# EAGLE design throwing_bagels (EAGLE 9.5.2)
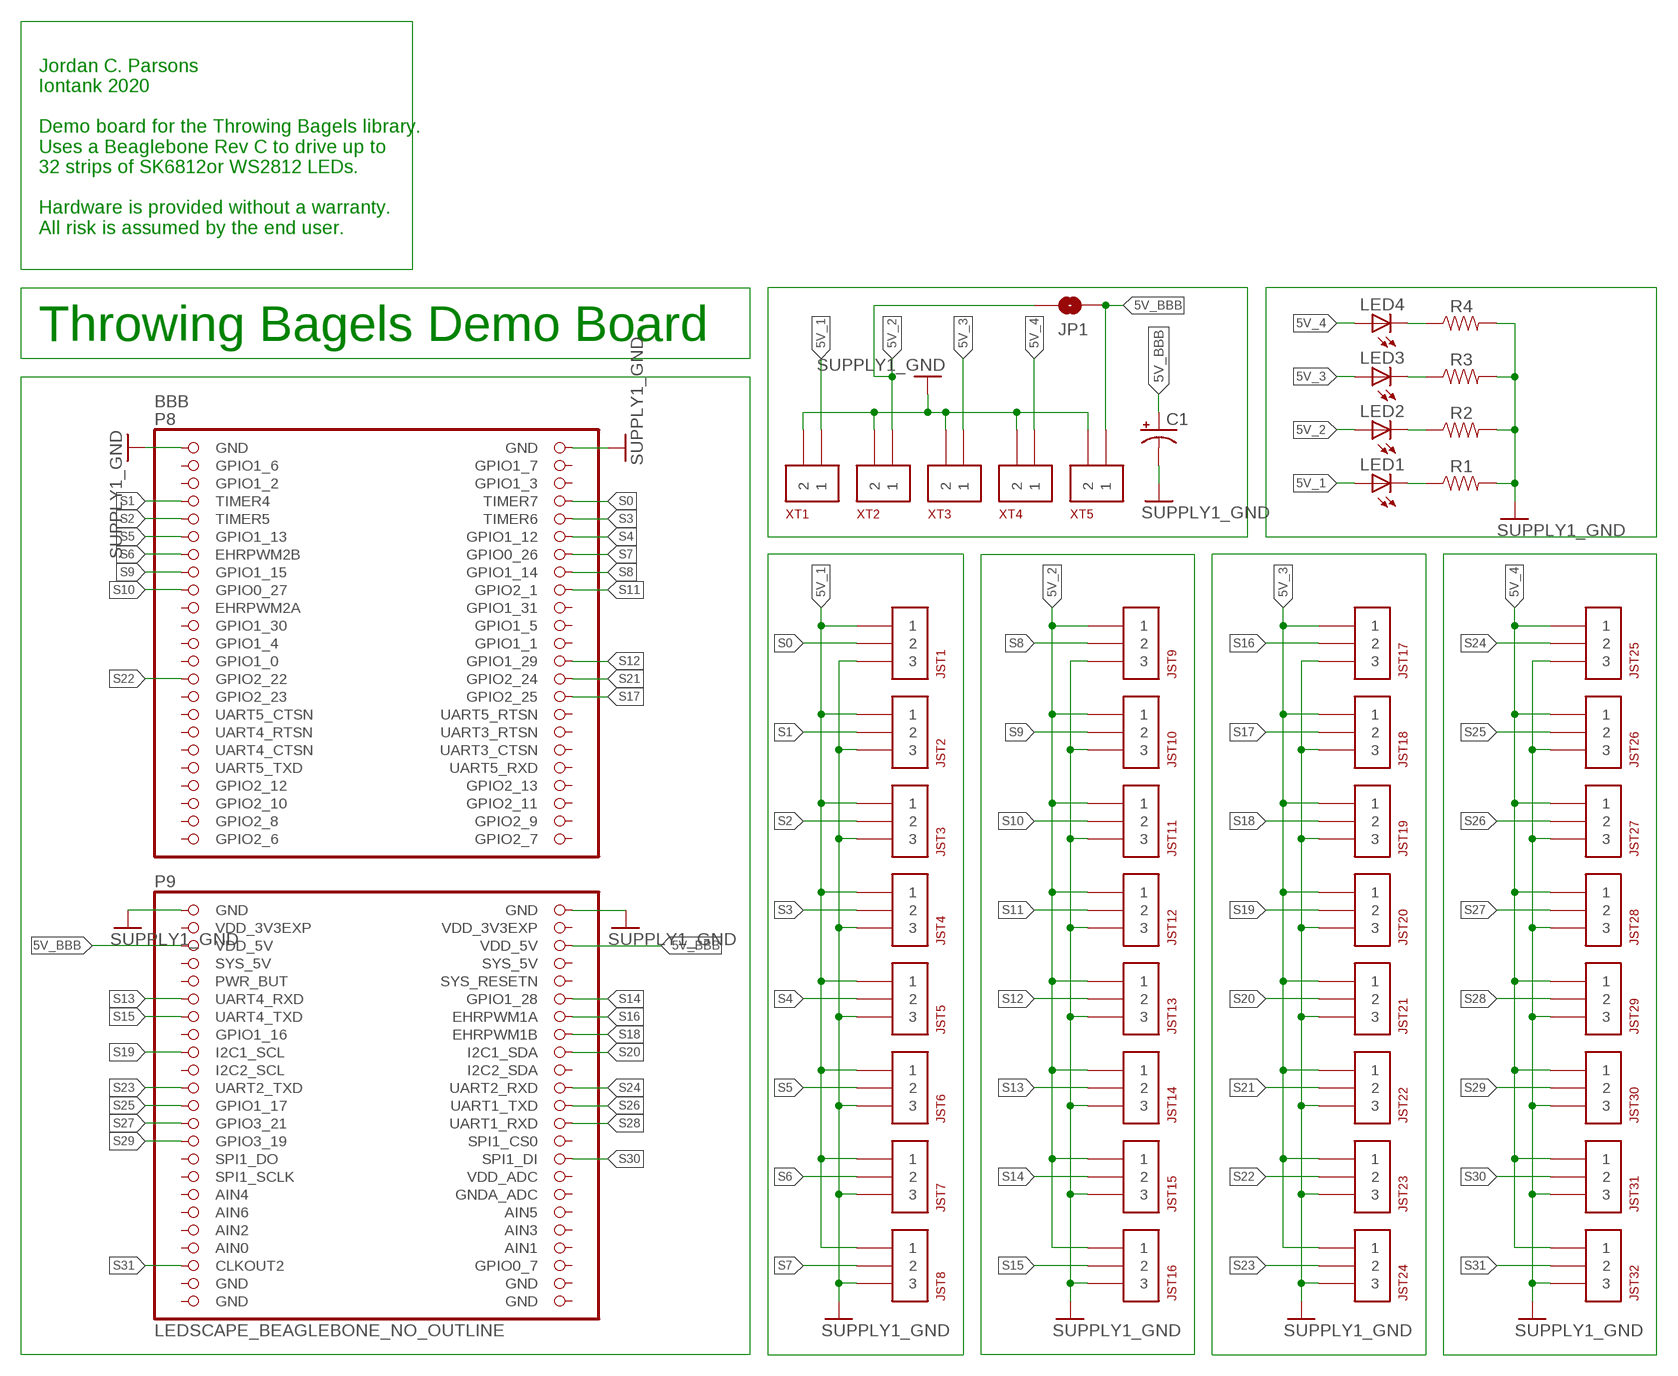
[diagram p0: schematic, sheet 1]

## Parts
BBB  LEDSCAPE_BEAGLEBONE_NO_OUTLINE  [BEAGLEBONE_SHIELD_NO_OUTLINE]
C1  ADAFRUIT_CPOL-USE2,5-6E  [ADAFRUIT_E2,5-6E]
JP1  SPARKFUN-JUMPERS_JUMPER-SMT_2_NO_SILK  [SPARKFUN-JUMPERS_SMT-JUMPER_2_NO_SILK]
JST1  IONTANK-JCP_JST-XH-SIDE-3  [JST-XH-SIDE-3]
JST2  IONTANK-JCP_JST-XH-SIDE-3  [JST-XH-SIDE-3]
JST3  IONTANK-JCP_JST-XH-SIDE-3  [JST-XH-SIDE-3]
JST4  IONTANK-JCP_JST-XH-SIDE-3  [JST-XH-SIDE-3]
JST5  IONTANK-JCP_JST-XH-SIDE-3  [JST-XH-SIDE-3]
JST6  IONTANK-JCP_JST-XH-SIDE-3  [JST-XH-SIDE-3]
JST7  IONTANK-JCP_JST-XH-SIDE-3  [JST-XH-SIDE-3]
JST8  IONTANK-JCP_JST-XH-SIDE-3  [JST-XH-SIDE-3]
JST9  IONTANK-JCP_JST-XH-SIDE-3  [JST-XH-SIDE-3]
JST10  IONTANK-JCP_JST-XH-SIDE-3  [JST-XH-SIDE-3]
JST11  IONTANK-JCP_JST-XH-SIDE-3  [JST-XH-SIDE-3]
JST12  IONTANK-JCP_JST-XH-SIDE-3  [JST-XH-SIDE-3]
JST13  IONTANK-JCP_JST-XH-SIDE-3  [JST-XH-SIDE-3]
JST14  IONTANK-JCP_JST-XH-SIDE-3  [JST-XH-SIDE-3]
JST15  IONTANK-JCP_JST-XH-SIDE-3  [JST-XH-SIDE-3]
JST16  IONTANK-JCP_JST-XH-SIDE-3  [JST-XH-SIDE-3]
JST17  IONTANK-JCP_JST-XH-SIDE-3  [JST-XH-SIDE-3]
JST18  IONTANK-JCP_JST-XH-SIDE-3  [JST-XH-SIDE-3]
JST19  IONTANK-JCP_JST-XH-SIDE-3  [JST-XH-SIDE-3]
JST20  IONTANK-JCP_JST-XH-SIDE-3  [JST-XH-SIDE-3]
JST21  IONTANK-JCP_JST-XH-SIDE-3  [JST-XH-SIDE-3]
JST22  IONTANK-JCP_JST-XH-SIDE-3  [JST-XH-SIDE-3]
JST23  IONTANK-JCP_JST-XH-SIDE-3  [JST-XH-SIDE-3]
JST24  IONTANK-JCP_JST-XH-SIDE-3  [JST-XH-SIDE-3]
JST25  IONTANK-JCP_JST-XH-SIDE-3  [JST-XH-SIDE-3]
JST26  IONTANK-JCP_JST-XH-SIDE-3  [JST-XH-SIDE-3]
JST27  IONTANK-JCP_JST-XH-SIDE-3  [JST-XH-SIDE-3]
JST28  IONTANK-JCP_JST-XH-SIDE-3  [JST-XH-SIDE-3]
JST29  IONTANK-JCP_JST-XH-SIDE-3  [JST-XH-SIDE-3]
JST30  IONTANK-JCP_JST-XH-SIDE-3  [JST-XH-SIDE-3]
JST31  IONTANK-JCP_JST-XH-SIDE-3  [JST-XH-SIDE-3]
JST32  IONTANK-JCP_JST-XH-SIDE-3  [JST-XH-SIDE-3]
LED1  LEDCHIPLED_0603  [CHIPLED_0603]
LED2  LEDCHIPLED_0603  [CHIPLED_0603]
LED3  LEDCHIPLED_0603  [CHIPLED_0603]
LED4  LEDCHIPLED_0603  [CHIPLED_0603]
R1  RESISTOR0603  [0603]
R2  RESISTOR0603  [0603]
R3  RESISTOR0603  [0603]
R4  RESISTOR0603  [0603]
XT1  IONTANK-JCP_XT60PWXT60PW-F20  [XT60PW-F20]
XT2  IONTANK-JCP_XT60PWXT60PW-F20  [XT60PW-F20]
XT3  IONTANK-JCP_XT60PWXT60PW-F20  [XT60PW-F20]
XT4  IONTANK-JCP_XT60PWXT60PW-F20  [XT60PW-F20]
XT5  IONTANK-JCP_XT30PW  [XT30PW-F]

## Nets
5V_1: JST1.P$1 JST2.P$1 JST3.P$1 JST4.P$1 JST5.P$1 JST6.P$1 JST7.P$1 JST8.P$1 LED1.A XT1.VCC
5V_2: JP1.1 JST9.P$1 JST10.P$1 JST11.P$1 JST12.P$1 JST13.P$1 JST14.P$1 JST15.P$1 JST16.P$1 LED2.A XT2.VCC
5V_3: JST17.P$1 JST18.P$1 JST19.P$1 JST20.P$1 JST21.P$1 JST22.P$1 JST23.P$1 JST24.P$1 LED3.A XT3.VCC
5V_4: JST25.P$1 JST26.P$1 JST27.P$1 JST28.P$1 JST29.P$1 JST30.P$1 JST31.P$1 JST32.P$1 LED4.A XT4.VCC
5V_BBB: BBB.51(VDD_5V) BBB.52(VDD_5V) C1.+ JP1.2 XT5.POS
GND: BBB.1(GND) BBB.2(GND) BBB.47(GND) BBB.48(GND) C1.- JST1.P$3 JST2.P$3 JST3.P$3 JST4.P$3 JST5.P$3 JST6.P$3 JST7.P$3 JST8.P$3 JST9.P$3 JST10.P$3 JST11.P$3 JST12.P$3 JST13.P$3 JST14.P$3 JST15.P$3 JST16.P$3 JST17.P$3 JST18.P$3 JST19.P$3 JST20.P$3 JST21.P$3 JST22.P$3 JST23.P$3 JST24.P$3 JST25.P$3 JST26.P$3 JST27.P$3 JST28.P$3 JST29.P$3 JST30.P$3 JST31.P$3 JST32.P$3 R1.2 R2.2 R3.2 R4.2 XT1.GND XT2.GND XT3.GND XT4.GND XT5.NEG ; supply symbol labelled SUPPLY1_GND
N$1: LED4.C R4.1
N$10: LED3.C R3.1
N$11: LED2.C R2.1
N$17: LED1.C R1.1
S0: BBB.8(TIMER7) JST1.P$2
S1: BBB.7(TIMER4) JST2.P$2
S2: BBB.9(TIMER5) JST3.P$2
S3: BBB.10(TIMER6) JST4.P$2
S4: BBB.12(GPIO1_12) JST5.P$2
S5: BBB.11(GPIO1_13) JST6.P$2
S6: BBB.13(EHRPWM2B) JST7.P$2
S7: BBB.14(GPIO0_26) JST8.P$2
S8: BBB.16(GPIO1_14) JST9.P$2
S9: BBB.15(GPIO1_15) JST10.P$2
S10: BBB.17(GPIO0_27) JST11.P$2
S11: BBB.18(GPIO2_1) JST12.P$2
S12: BBB.26(GPIO1_29) JST13.P$2
S13: BBB.57(UART4_RXD) JST14.P$2
S14: BBB.58(GPIO1_28) JST15.P$2
S15: BBB.59(UART4_TXD) JST16.P$2
S16: BBB.60(EHRPWM1A) JST17.P$2
S17: BBB.30(GPIO2_25) JST18.P$2
S18: BBB.62(EHRPWM1B) JST19.P$2
S19: BBB.63(I2C1_SCL) JST20.P$2
S20: BBB.64(I2C1_SDA) JST21.P$2
S21: BBB.28(GPIO2_24) JST22.P$2
S22: BBB.27(GPIO2_22) JST23.P$2
S23: BBB.67(UART2_TXD) JST24.P$2
S24: BBB.68(UART2_RXD) JST25.P$2
S25: BBB.69(GPIO1_17) JST26.P$2
S26: BBB.70(UART1_TXD) JST27.P$2
S27: BBB.71(GPIO3_21) JST28.P$2
S28: BBB.72(UART1_RXD) JST29.P$2
S29: BBB.73(GPIO3_19) JST30.P$2
S30: BBB.76(SPI1_DI) JST31.P$2
S31: BBB.87(CLKOUT2) JST32.P$2
Unconnected: BBB.3(GPIO1_6) BBB.4(GPIO1_7) BBB.5(GPIO1_2) BBB.6(GPIO1_3) BBB.19(EHRPWM2A) BBB.20(GPIO1_31) BBB.21(GPIO1_30) BBB.22(GPIO1_5) BBB.23(GPIO1_4) BBB.24(GPIO1_1) BBB.25(GPIO1_0) BBB.29(GPIO2_23) BBB.31(UART5_CTSN) BBB.32(UART5_RTSN) BBB.33(UART4_RTSN) BBB.34(UART3_RTSN) BBB.35(UART4_CTSN) BBB.36(UART3_CTSN) BBB.37(UART5_TXD) BBB.38(UART5_RXD) BBB.39(GPIO2_12) BBB.40(GPIO2_13) BBB.41(GPIO2_10) BBB.42(GPIO2_11) BBB.43(GPIO2_8) BBB.44(GPIO2_9) BBB.45(GPIO2_6) BBB.46(GPIO2_7) BBB.54(SYS_5V) BBB.55(PWR_BUT) BBB.56(SYS_RESETN) BBB.61(GPIO1_16) BBB.65(I2C2_SCL) BBB.66(I2C2_SDA) BBB.74(SPI1_CS0) BBB.75(SPI1_DO) BBB.77(SPI1_SCLK) BBB.78(VDD_ADC) BBB.79(AIN4) BBB.80(GNDA_ADC) BBB.81(AIN6) BBB.82(AIN5) BBB.83(AIN2) BBB.84(AIN3) BBB.86(AIN1) BBB.88(GPIO0_7)

## Notes on the sheet
- Jordan C. Parsons
  Iontank 2020
  
  Demo board for the Throwing Bagels library.
  Uses a Beaglebone Rev C to drive up to 
  32 strips of SK6812or WS2812 LEDs. 
  
  Hardware is provided without a warranty. 
  All risk is assumed by the end user.
- Throwing Bagels Demo Board

## Power pins joined to a net without a drawn wire
AIN0: BBB.85(AIN0)
GND: BBB.89(GND) BBB.90(GND) BBB.91(GND) BBB.92(GND)
SYS_5V: BBB.53(SYS_5V)
VDD_3V3EXP: BBB.49(VDD_3V3EXP) BBB.50(VDD_3V3EXP)

## Library data of the parts
BBB = throwing_bagels:LEDSCAPE_BEAGLEBONE_NO_OUTLINE: Should match A3 pinout - but not completely tested
C1 = throwing_bagels:ADAFRUIT_CPOL-US: POLARIZED CAPACITOR, American symbol
JP1 = throwing_bagels:SPARKFUN-JUMPERS_JUMPER-SMT_2_NO: Normally open jumper This jumper has two pads in close proximity to each other. Apply solder to close the connection. Round pads are easier to solder for beginners, but are a lot larger. SparkFun Product that uses the round pads: SparkFun EL Sequencer <https://www.sparkfun.com/products/12781>
JST1-JST32 = throwing_bagels:IONTANK-JCP_JST-XH-SIDE-3: http://www.jst-mfg.com/product/pdf/eng/eXH.pdf
LED1-LED4 = adafruit:LED: LED OSRAM: - CHIPLED LG R971, LG N971, LY N971, LG Q971, LY Q971, LO R971, LY R971 LH N974, LH R974 LS Q976, LO Q976, LY Q976 LO Q996 - Hyper CHIPLED LW Q18S LB Q993, LB Q99A, LB R99A - SideLED LS A670, LO A670, LY A670, LG A670, LP A670 LB A673, LV A673, LT A673, LW A673 LH A674 LY A675 LS A676, LA A676, LO A676, LY A676, LW A676 LS A679, LY A679, LG A679 - Hyper Micro SIDELED® LS Y876, LA Y876, LO Y876, LY Y876 LT Y87S - SmartLED LW L88C, LW L88S LB L89C, LB L89S, LG L890 LS L89K, LO L89K, LY L89K LS L896, LA L896, LO L896, LY L896 - TOPLED LS T670, LO T670, LY T670, LG T670, LP T670 LSG T670, LSP T670, LSY T670, LOP T670, LYG T670 LG T671, LOG T671, LSG T671 LB T673, LV T673, LT T673, LW T673 LH T674 LS T676, LA T676, LO T676, LY T676, LB T676, LH T676, LSB T676, LW T676 LB T67C, LV T67C, LT T67C, LS T67K, LO T67K, LY T67K, LW E67C LS E67B, LA E67B, LO E67B, LY E67B, LB E67C, LV E67C, LT E67C LW T67C LS T679, LY T679, LG T679 LS T770, LO T770, LY T770, LG T770, LP T770 LB T773, LV T773, LT T773, LW T773 LH T774 LS E675, LA E675, LY E675, LS T675 LS T776, LA T776, LO T776, LY T776, LB T776 LHGB T686 LT T68C, LB T68C - Hyper Mini TOPLED® LB M676 - Mini TOPLED Santana® LG M470 LS M47K, LO M47K, LY M47K Source: http://www.osram.convergy.de/
R1-R4 = SparkFun-Resistors:RESISTOR: Generic Resistor Package
XT1-XT4 = throwing_bagels:IONTANK-JCP_XT60PW
XT5 = throwing_bagels:IONTANK-JCP_XT30PW

## Board
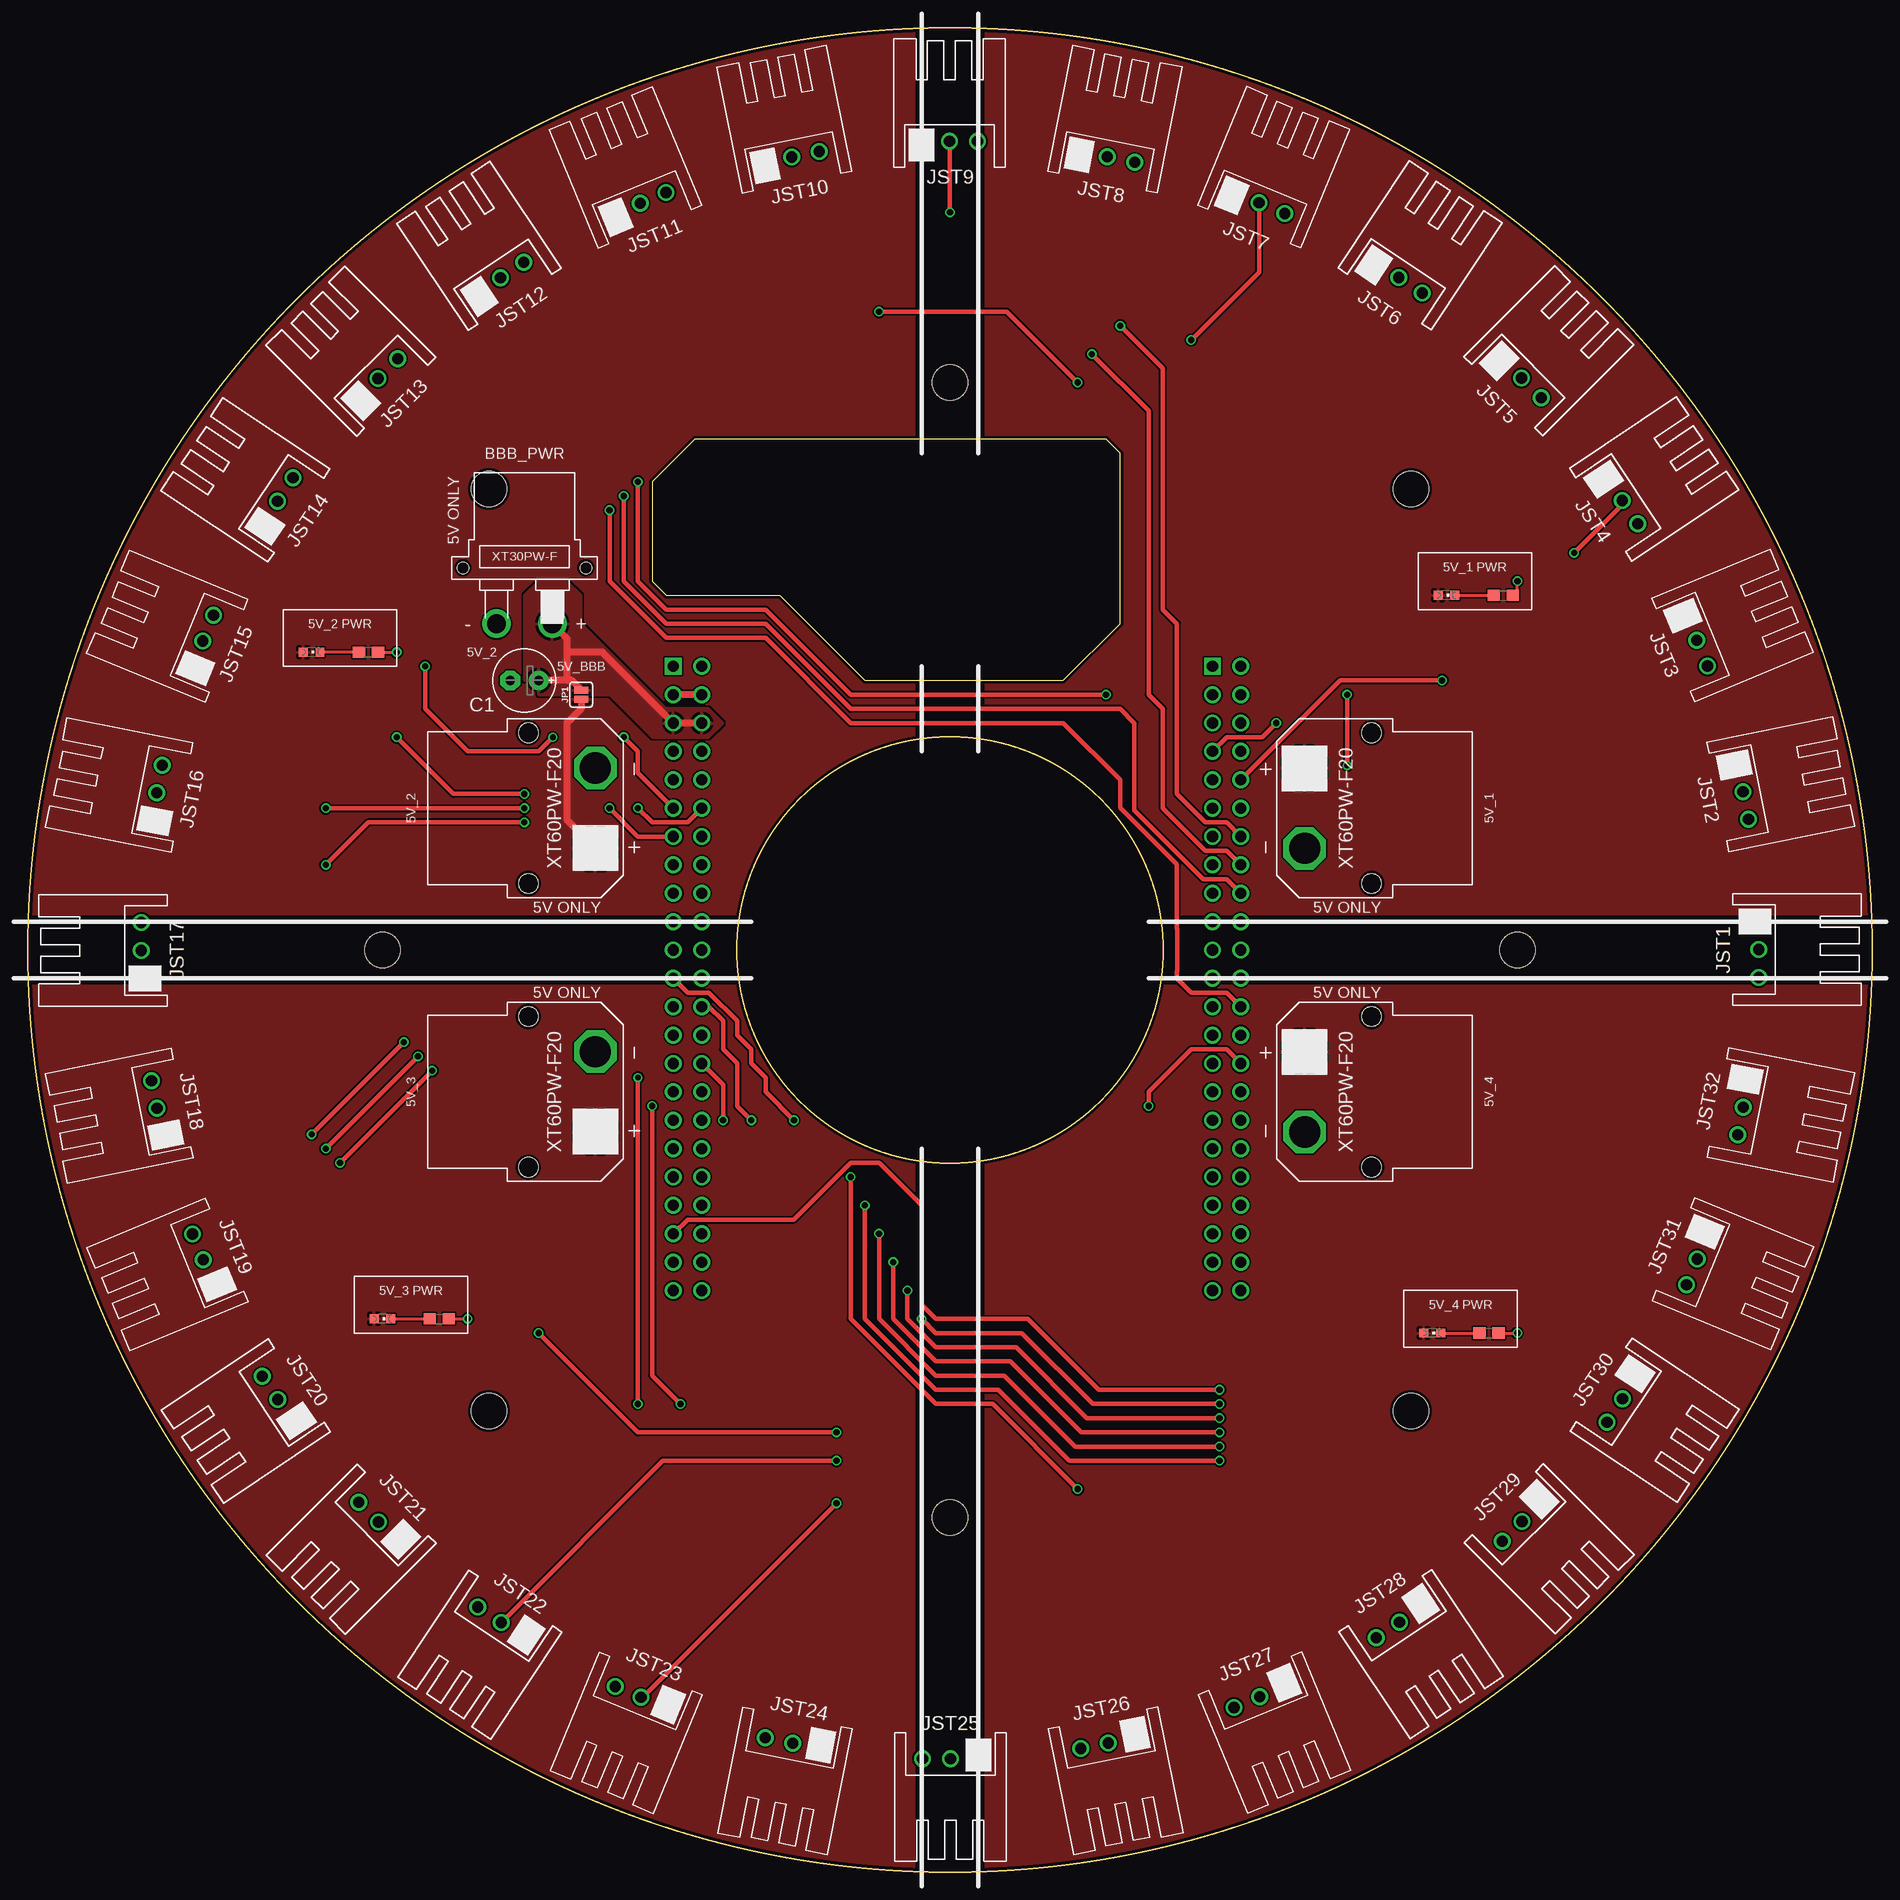
[diagram p1: board, top side]
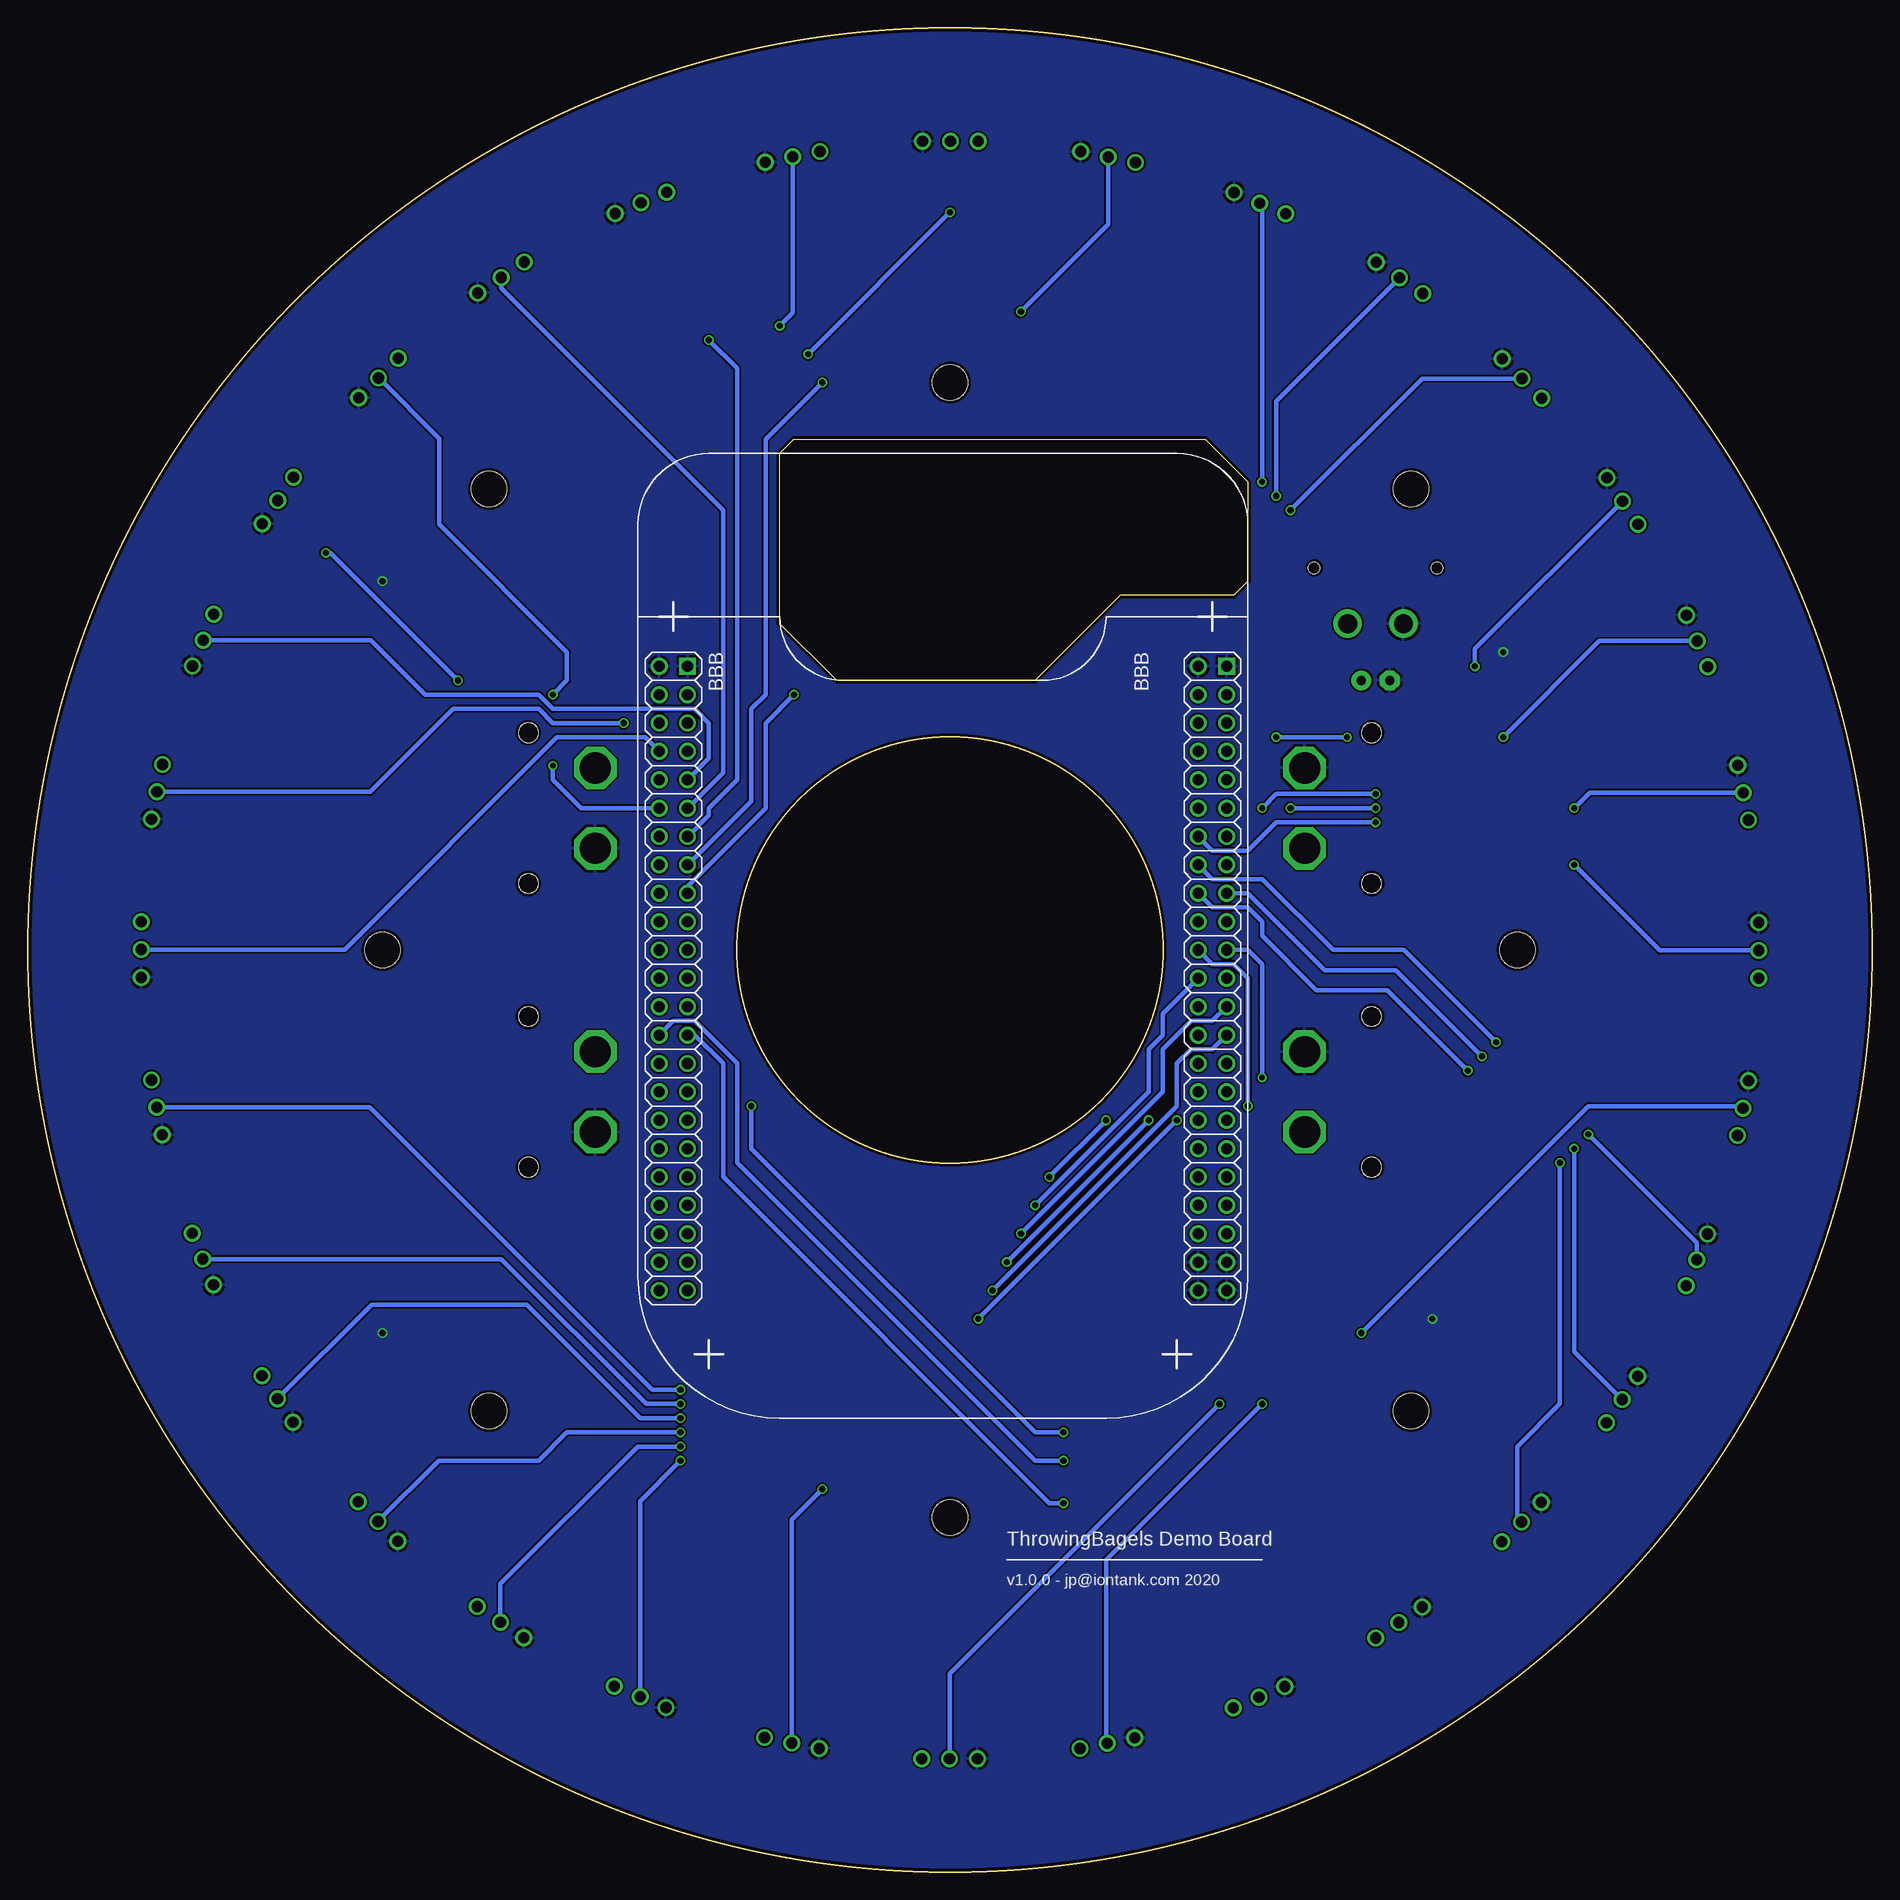
[diagram p2: board, bottom side, seen from below]

Size 165.1 x 165.1 mm. Coordinates in mm from the lower left corner, seen from the top.
Outline: 59.69,128.27 55.88,124.46 55.88,115.57 57.15,114.3 67.31,114.3 74.93,106.68 92.71,106.68 97.79,111.76 97.79,127 96.52,128.27 59.69,128.27
Outline: circle at 82.55,82.55 radius 19.05
Outline: circle at 82.55,82.55 radius 82.55
Copper layers (1*16): Top 0.035mm / dielectric 1.5mm / Bottom 0.035mm
Design rules "SeeedStudio_2layer_DRU_no_angle_20140221": minimum track width 6mil, minimum drill 12mil, track to track 6mil, track to pad 6mil, pad to pad 6mil, via to via 6mil, smd to smd 0mil, copper to edge 10mil, drill to drill 10mil, minimum pad ring 10mil, minimum via ring 6mil, stop-mask expansion 2mil, vias tented up to drill 100mil, thermal gap 10mil
Holes 3.17 mm at 82.55,133.35 31.75,82.55 133.35,82.55 82.55,31.75 41.27,41.27 41.27,123.82 123.82,123.82 123.82,41.27

### Footprints (pad centres in the part's own frame; a part is rotated, then mirrored left to right if it is on the bottom)
BEAGLEBONE_SHIELD_NO_OUTLINE = drill 1 square: 1 4.445,19.05; 47 52.705,19.05 | drill 1: 2 1.905,19.05; 3 4.445,21.59; 4 1.905,21.59; 5 4.445,24.13; 6 1.905,24.13; 7 4.445,26.67; 8 1.905,26.67; 9 4.445,29.21; 10 1.905,29.21; 11 4.445,31.75; 12 1.905,31.75; 13 4.445,34.29; 14 1.905,34.29; 15 4.445,36.83; 16 1.905,36.83; 17 4.445,39.37; 18 1.905,39.37; 19 4.445,41.91; 20 1.905,41.91; 21 4.445,44.45; 22 1.905,44.45; 23 4.445,46.99; 24 1.905,46.99; 25 4.445,49.53; 26 1.905,49.53; 27 4.445,52.07; 28 1.905,52.07; 29 4.445,54.61; 30 1.905,54.61; 31 4.445,57.15; 32 1.905,57.15; 33 4.445,59.69; 34 1.905,59.69; 35 4.445,62.23; 36 1.905,62.23; 37 4.445,64.77; 38 1.905,64.77; 39 4.445,67.31; 40 1.905,67.31; 41 4.445,69.85; 42 1.905,69.85; 43 4.445,72.39; 44 1.905,72.39; 45 4.445,74.93; 46 1.905,74.93; 48 50.165,19.05; 49 52.705,21.59; 50 50.165,21.59; 51 52.705,24.13; 52 50.165,24.13; 53 52.705,26.67; 54 50.165,26.67; 55 52.705,29.21; 56 50.165,29.21; 57 52.705,31.75; 58 50.165,31.75; 59 52.705,34.29; 60 50.165,34.29; 61 52.705,36.83; 62 50.165,36.83; 63 52.705,39.37; 64 50.165,39.37; 65 52.705,41.91; 66 50.165,41.91; 67 52.705,44.45; 68 50.165,44.45; 69 52.705,46.99; 70 50.165,46.99; 71 52.705,49.53; 72 50.165,49.53; 73 52.705,52.07; 74 50.165,52.07; 75 52.705,54.61; 76 50.165,54.61; 77 52.705,57.15; 78 50.165,57.15; 79 52.705,59.69; 80 50.165,59.69; 81 52.705,62.23; 82 50.165,62.23; 83 52.705,64.77; 84 50.165,64.77; 85 52.705,67.31; 86 50.165,67.31; 87 52.705,69.85; 88 50.165,69.85; 89 52.705,72.39; 90 50.165,72.39; 91 52.705,74.93; 92 50.165,74.93
ADAFRUIT_E2,5-6E = drill 0.813 pad 1.778: + -1.27,0 | drill 0.813 pad 1.778 octagon: - 1.27,0
SPARKFUN-JUMPERS_SMT-JUMPER_2_NO_SILK = smd 0.635 x 1.27: 1 -0.406,0; 2 0.406,0
JST-XH-SIDE-3 = drill 1: P$1 -2.54,-3.81; P$2 -0.04,-3.81; P$3 2.46,-3.81
CHIPLED_0603 = smd 0.8 x 0.8: A 0,-0.75; C 0,0.75
0603 = smd 1.1 x 1: 1 -0.85,0; 2 0.85,0
XT60PW-F20 = drill 2.8 octagon: GND 3.6,0; VCC -3.6,0 | hole 1.75: 6.75,6; -6.75,6
XT30PW-F = drill 1.7: NEG -2.5,0; POS 2.5,0 | hole 1: 5.5,5; -5.5,5

### Placement (x,y rotation side)
BBB  110.49,127 180 top
C1  44.45,106.68 180 top
JP1  49.53,105.41 90 top
JST1  158.75,82.55 270 top
JST2  157.29,97.42 281.3 top
JST3  152.95,111.71 292.5 top
JST4  145.91,124.88 303.8 top
JST5  136.43,136.43 315 top
JST6  124.88,145.91 326.3 top
JST7  111.71,152.95 337.5 top
JST8  97.42,157.29 348.8 top
JST9  82.55,158.75 0 top
JST10  67.68,157.29 11.3 top
JST11  53.39,152.95 22.5 top
JST12  40.22,145.91 33.8 top
JST13  28.67,136.43 45 top
JST14  19.19,124.88 56.3 top
JST15  12.15,111.71 67.5 top
JST16  7.81,97.42 78.8 top
JST17  6.35,82.55 90 top
JST18  7.81,67.68 101.3 top
JST19  12.15,53.39 112.5 top
JST20  19.19,40.22 123.8 top
JST21  28.67,28.67 135 top
JST22  40.22,19.19 146.3 top
JST23  53.39,12.15 157.5 top
JST24  67.68,7.81 168.8 top
JST25  82.55,6.35 180 top
JST26  97.42,7.81 191.3 top
JST27  111.71,12.15 202.5 top
JST28  124.88,19.19 213.8 top
JST29  136.43,28.67 225 top
JST30  145.91,40.22 236.3 top
JST31  152.95,53.39 247.5 top
JST32  157.29,67.68 258.8 top
LED1  127,114.3 270 top
LED2  25.4,109.22 270 top
LED3  31.75,49.53 270 top
LED4  125.73,48.26 270 top
R1  132.08,114.3 0 top
R2  30.48,109.22 0 top
R3  36.83,49.53 0 top
R4  130.81,48.26 0 top
XT1  114.3,95.25 270 top
XT2  50.8,95.25 90 top
XT3  50.8,69.85 90 top
XT4  114.3,69.85 270 top
XT5  44.45,111.76 0 top

### Tracks (layer width: path | path; a pad name or v marks a point on that pad's centre or on a via)
5V_1
  pour Top: 85.72,168.27 85.72,136.53 85.72,85.72 117.47,85.72 168.27,85.72 168.27,88.9 168.27,168.27
5V_2
  Top 0.61: XT2.VCC 48.26,94.19 48.26,102.87 49.53,104.14 JP1.1
  pour Top (rank 2): 79.38,85.72 79.38,168.27 -3.17,168.27 -3.17,85.72
5V_3
  pour Top: 79.38,79.38 25.4,79.38 -3.17,79.38 -3.17,73.02 -3.17,-3.17 79.38,-3.17
5V_4
  pour Top: 85.72,79.38 168.27,79.38 168.27,38.1 168.27,-3.17 85.72,-3.17
5V_BBB
  Top 0.61: XT5.POS 48.26,110.45 48.26,109.22 | 48.26,106.68 C1.+ | 48.26,109.22 48.26,106.68 | BBB.52 BBB.51 51.44,109.22 48.26,109.22 | JP1.2 48.67,106.68 48.26,106.68
  pour Top: 44.45,114.3 44.45,110.49 44.45,106.68 45.72,105.41 50.8,105.41 52.07,105.41 55.88,101.6 60.96,101.6 62.23,102.87 60.96,104.14 57.15,104.14 49.53,111.76 49.53,113.03 49.53,114.3 48.26,115.57 45.72,115.57
GND  (via drill 0.55)
  Top 0.254: R2.2 v33.02,109.22 | R1.2 133.35,114.72 v133.35,115.57 | R4.2 v133.35,48.26 | R3.2 v39.37,49.53
  pour Bottom: -6.35,171.45 171.45,171.45 171.45,76.2 171.45,-6.35 82.55,-6.35 -6.35,-6.35 -6.35,76.2
N$1
  Top 0.254: LED4.C R4.1
N$10
  Top 0.254: LED3.C R3.1
N$11
  Top 0.254: R2.1 LED2.C
N$17
  Top 0.254: LED1.C R1.1
S0
  Bottom 0.406: BBB.8 109.85,101.6 117.74,101.6 136.75,82.59 JST1.P$2
S1  (via drill 0.55)
  Top 0.406: BBB.7 107.31,101.6 110.49,101.6 v111.76,102.87
  Bottom 0.406: JST2.P$2 134.43,96.71 127,104.14 119.38,104.14 118.11,102.87 v111.76,102.87
S2
  Bottom 0.406: BBB.9 104.14,99.69 104.14,102.87 105.41,104.14 118.11,104.14 119.38,105.41 129.54,105.41 134.42,110.29 JST3.P$2
S3  (via drill 0.55)
  Top 0.406: BBB.10 117.47,106.68 v126.6,106.68 | v138.43,118.11 142.72,122.4 JST4.P$2
  Bottom 0.406: v126.6,106.68 138.03,118.11 v138.43,118.11
S4  (via drill 0.5, 0.55)
  Top 0.406: v118.11,99.06 v118.11,105.41
  Bottom 0.406: BBB.12 115.57,95.25 118.11,97.79 v118.11,99.06 | v118.11,105.41 116.84,106.68 116.84,109.22 128.27,120.65 128.27,128.33 JST5.P$2
S5
  Bottom 0.406: BBB.11 102.87,98.42 102.87,121.92 122.74,141.79 JST6.P$2
S6  (via drill 0.55)
  Top 0.406: v104.14,137.16 110.22,143.24 JST7.P$2
  Bottom 0.406: BBB.13 104.14,94.61 104.14,95.25 101.6,97.79 101.6,134.62 v104.14,137.16
S7  (via drill 0.55)
  Top 0.406: BBB.14 107.31,93.98 105.41,93.98 102.87,96.52 102.87,111.76 101.6,113.03 101.6,134.62 v97.79,138.43
  Bottom 0.406: v97.79,138.43 96.64,139.58 JST8.P$2
S8  (via drill 0.55)
  Top 0.406: BBB.16 107.31,91.44 105.41,91.44 101.6,95.25 101.6,104.14 100.33,105.41 100.33,130.81 v95.25,135.89 | JST9.P$2 82.55,154.9 v82.55,148.59
  Bottom 0.406: v82.55,148.59 v95.25,135.89
S9  (via drill 0.55)
  Top 0.406: v76.2,139.7 87.63,139.7 v93.98,133.35
  Bottom 0.406: BBB.15 100.33,95.88 100.33,104.14 99.06,105.41 99.06,128.27 v93.98,133.35 | v76.2,139.7 68.39,147.51 JST10.P$2
S10  (via drill 0.55)
  Top 0.406: v96.52,105.41 73.66,105.41 66.04,113.03 57.15,113.03 54.61,115.57 v54.61,124.46
  Bottom 0.406: BBB.17 106.05,88.27 99.06,95.25 99.06,102.87 v96.52,105.41 | JST11.P$2 54.61,149.21 v54.61,124.46
S11  (via drill 0.55)
  Top 0.406: BBB.18 107.31,88.9 105.23,88.9 99.06,95.07 99.06,102.87 97.79,104.14 73.66,104.14 66.04,111.76 57.15,111.76 53.34,115.57 v53.34,123.19
  Bottom 0.406: v53.34,123.19 53.34,131.68 JST12.P$2
S12  (via drill 0.55)
  Top 0.406: BBB.26 107.31,78.74 104.14,78.74 102.87,80.01 102.87,80.63 102.89,80.65 102.89,84.45 102.87,84.47 102.87,90.22 97.79,95.3 97.79,97.79 92.71,102.87 73.66,102.87 66.04,110.49 57.15,110.49 52.07,115.57 v52.07,121.92
  Bottom 0.406: JST13.P$2 40.28,133.71 v52.07,121.92
S13  (via drill 0.5, 0.55)
  Top 0.406: BBB.57 54.61,98.42 54.61,100.33 v53.34,101.6 | v46.99,101.6 45.72,100.33 39.37,100.33 35.56,104.14 v35.56,107.95
  Bottom 0.406: v53.34,101.6 v46.99,101.6 | JST14.P$2 35.56,109.52 v35.56,107.95
S14  (via drill 0.55)
  Top 0.406: BBB.58 59.05,93.98 55.88,93.98 v54.61,95.25 | v33.02,101.6 38.1,96.52 v44.45,96.52
  Bottom 0.406: v54.61,95.25 53.34,96.52 v44.45,96.52 | v33.02,101.6 24.4,110.22 JST15.P$2
S15  (via drill 0.55)
  Top 0.406: BBB.59 54.61,92.71 v52.07,95.25 | v26.67,95.25 v44.45,95.25
  Bottom 0.406: v52.07,95.25 v44.45,95.25 | JST16.P$2 25.28,96.64 v26.67,95.25
S16  (via drill 0.55)
  Top 0.406: v26.67,90.17 30.48,93.98 v44.45,93.98
  Bottom 0.406: BBB.60 59.05,91.44 55.88,91.44 53.34,93.98 v44.45,93.98 | v26.67,90.17 19.01,82.51 JST17.P$2
S17  (via drill 0.55)
  Top 0.406: BBB.30 107.31,73.66 104.14,73.66 100.33,69.85 v100.33,68.58 | v72.39,39.37 54.61,39.37 v45.72,48.26
  Bottom 0.406: v100.33,68.58 100.33,64.77 74.93,39.37 v72.39,39.37 | v45.72,48.26 25.4,68.58 11.75,68.58 JST18.P$2
S18  (via drill 0.55)
  Top 0.406: v33.65,74.3 v25.4,66.04
  Bottom 0.406: BBB.62 59.05,88.9 54.61,88.9 48.26,82.55 41.91,82.55 v33.65,74.3 | v25.4,66.04 15.69,56.33 JST19.P$2
S19  (via drill 0.55)
  Top 0.406: v34.92,73.02 v26.67,64.77
  Bottom 0.406: BBB.63 55.88,87.63 49,80.75 42.65,80.75 v34.92,73.02 | v26.67,64.77 26.67,46.59 JST20.P$2
S20  (via drill 0.55)
  Top 0.406: v36.2,71.75 v27.94,63.5
  Bottom 0.406: BBB.64 59.05,86.36 55.88,86.36 54.61,85.09 54.61,83.82 49.75,78.96 43.4,78.96 v36.2,71.75 | v27.94,63.5 27.94,41.91 31.75,38.1 31.75,31.69 JST21.P$2
S21  (via drill 0.55)
  Top 0.406: v72.39,36.83 56.85,36.83 JST22.P$2
  Bottom 0.406: BBB.28 107.31,76.2 105.41,76.2 101.6,72.39 101.6,63.5 74.93,36.83 v72.39,36.83
S22  (via drill 0.55)
  Top 0.406: v72.39,33.02 55.02,15.66 JST23.P$2
  Bottom 0.406: BBB.27 105.41,74.93 102.87,72.39 102.87,62.23 73.66,33.02 v72.39,33.02
S23  (via drill 0.5, 0.55)
  Top 0.406: v54.61,41.91 v54.61,71.12
  Bottom 0.406: BBB.67 55.88,82.55 54.61,81.28 v54.61,71.12 | JST24.P$2 68.58,11.66 68.58,27.94 v54.61,41.91
S24  (via drill 0.55)
  Top 0.406: v55.88,68.58 55.88,44.45 v58.42,41.91
  Bottom 0.406: BBB.68 59.05,81.28 57.15,81.28 55.88,80.01 v55.88,68.58 | JST25.P$2 82.59,17.74 v58.42,41.91
S25  (via drill 0.55)
  Top 0.406: BBB.69 59.05,78.74 60.96,78.74 63.5,76.2 63.5,74.93 64.77,73.66 64.77,72.39 66.04,71.12 66.04,69.85 v68.58,67.31 | v73.66,62.23 73.66,49.53 81.28,41.91 86.36,41.91 v93.98,34.29
  Bottom 0.406: v68.58,67.31 v73.66,62.23 | v93.98,34.29 96.71,31.56 JST26.P$2
S26  (via drill 0.55)
  Top 0.406: v74.93,59.69 74.93,49.53 81.28,43.18 86.89,43.18 93.24,36.83 v106.68,36.83
  Bottom 0.406: BBB.70 63.5,76.83 63.5,74.93 64.77,73.66 64.77,69.85 v74.93,59.69 | JST27.P$2 110.29,33.22 v106.68,36.83
S27  (via drill 0.55)
  Top 0.406: v76.2,57.15 76.2,49.53 81.28,44.45 87.41,44.45 93.76,38.1 v106.68,38.1
  Bottom 0.406: BBB.71 59.05,76.2 60.96,76.2 63.5,73.66 63.5,69.85 v76.2,57.15 | v106.68,38.1 110.49,38.1 122.8,25.79 JST28.P$2
S28  (via drill 0.55)
  Top 0.406: BBB.72 60.96,77.47 62.23,76.2 62.23,73.66 63.5,72.39 63.5,68.58 v64.77,67.31 | v77.47,54.61 77.47,49.53 81.28,45.72 87.94,45.72 94.29,39.37 v106.68,39.37
  Bottom 0.406: v64.77,67.31 v77.47,54.61 | v106.68,39.37 116.84,39.37 119.38,36.83 128.33,36.83 JST29.P$2
S29  (via drill 0.55)
  Top 0.406: v78.74,52.07 78.74,49.53 81.28,46.99 88.46,46.99 94.81,40.64 v106.68,40.64
  Bottom 0.406: BBB.73 59.05,73.66 60.96,73.66 62.23,72.39 62.23,68.58 v78.74,52.07 | v106.68,40.64 110.27,40.64 120.43,50.8 134.32,50.8 JST30.P$2
S30  (via drill 0.55)
  Top 0.406: BBB.76 62.23,70.48 v62.23,67.31 | v80.01,49.53 81.28,48.26 88.99,48.26 95.34,41.91 v106.68,41.91
  Bottom 0.406: v62.23,67.31 v80.01,49.53 | v106.68,41.91 109.75,41.91 122.72,54.88 JST31.P$2
S31  (via drill 0.55)
  Top 0.406: BBB.87 59.05,58.42 68.58,58.42 73.66,63.5 76.2,63.5 80.01,59.69 80.01,50.8 81.28,49.53 89.52,49.53 95.87,43.18 v106.68,43.18
  Bottom 0.406: v106.68,43.18 109.22,43.18 134.5,68.46 JST32.P$2
VDD_3V3EXP
  Top 0.61: BBB.50 BBB.49

### Text on the board
tPlace: BBB_PWR | 5V ONLY | 5V_1 PWR | 5V_2 PWR | 5V_2 | 5V_BBB | 5V_2 | 5V_1 | 5V ONLY | 5V ONLY | 5V ONLY | 5V ONLY | 5V_3 | 5V_4 | 5V_3 PWR | 5V_4 PWR
bPlace: ThrowingBagels Demo Board | v1.0.0 - jp@iontank.com 2020